# Altium schematic sheet Voltage_Regulation_TI.SchDoc
size A4
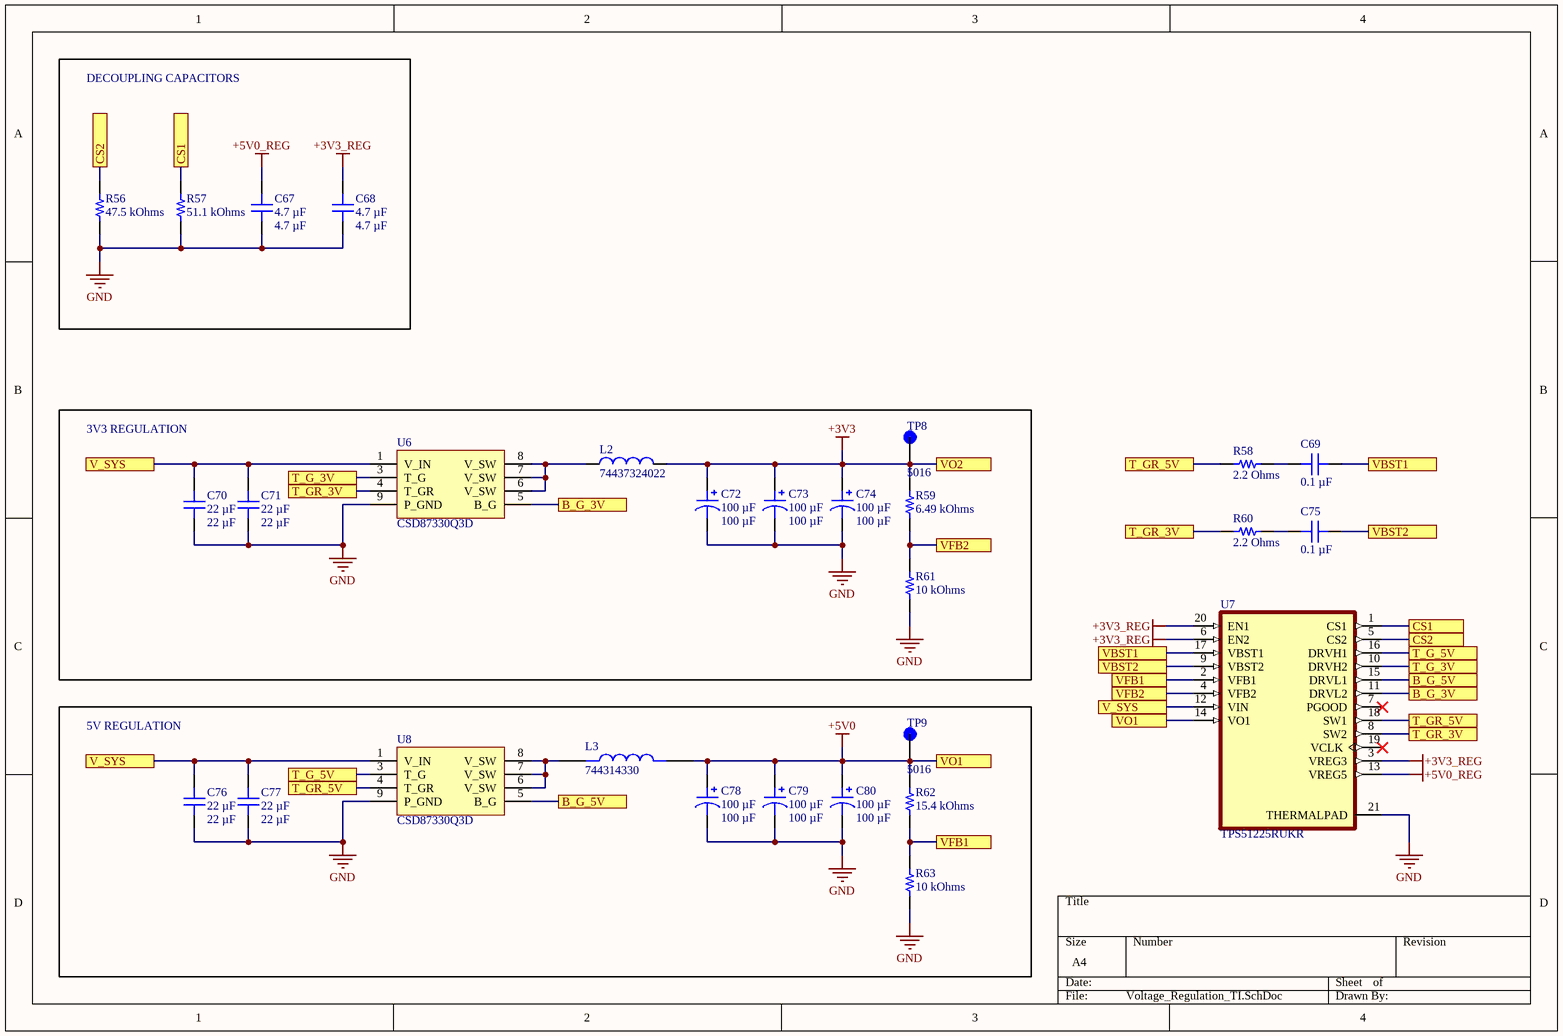
[diagram p0: Voltage_Regulation_TI.SchDoc]

## Parts
C67  4.7 µF  [CAP 0402_1005]
C68  4.7 µF  [CAP 0402_1005]
C69  0.1 µF  [CAP 0402_1005]
C70  22 µF  [CAP 0805_2012]
C71  22 µF  [CAP 0805_2012]
C72  100 µF  [CAP POL 1411_3528]
C73  100 µF  [CAP POL 1411_3528]
C74  100 µF  [CAP POL 1411_3528]
C75  0.1 µF  [CAP 0402_1005]
C76  22 µF  [CAP 0805_2012]
C77  22 µF  [CAP 0805_2012]
C78  100 µF  [CAP POL 1411_3528]
C79  100 µF  [CAP POL 1411_3528]
C80  100 µF  [CAP POL 1411_3528]
L2  74437324022  [IND_74437324022]
L3  744314330  [IND_744314330]
R56  47.5 kOhms  [RES 0402_1005]
R57  51.1 kOhms  [RES 0402_1005]
R58  2.2 Ohms  [RES 0402_1005]
R59  6.49 kOhms  [RES 0402_1005]
R60  2.2 Ohms  [RES 0402_1005]
R61  10 kOhms  [RES 0402_1005]
R62  15.4 kOhms  [RES 0402_1005]
R63  10 kOhms  [RES 0402_1005]
TP8  5016  [KEYSTONE_5016]  (no BOM)
TP9  5016  [KEYSTONE_5016]  (no BOM)
U6  CSD87330Q3D  [Q3D]
U7  TPS51225RUKR  [QFN40P300X300X80-21N]
U8  CSD87330Q3D  [Q3D]

## Blocks framed on the sheet
DECOUPLING CAPACITORS: C67 C68 R56 R57
3V3 REGULATION: C70-C74 L2 R59 R61 TP8 U6
5V REGULATION: C76-C80 L3 R62 R63 TP9 U8

## Ports
B_G_3V, B_G_5V, CS1, CS2, T_G_3V, T_G_5V, T_GR_3V, T_GR_5V, V_SYS, VBST1, VBST2, VFB1, VFB2, VO1, VO2

## Nets
+3V3: C72.1 C73.1 C74.1 L2.2 R59.2 TP8.TP ; port VO2
+3V3_REG: C68.2 U7.3(VREG3) U7.6(EN2) U7.20(EN1)
+5V0: C78.1 C79.1 C80.1 L3.2 R62.2 TP9.TP U7.14(VO1) ; port VO1
+5V0_REG: C67.2 U7.13(VREG5)
GND: C67.1 C68.1 C70.1 C71.1 C72.2 C73.2 C74.2 C76.1 C77.1 C78.2 C79.2 C80.2 R56.1 R57.1 R61.2 R63.2 U6.9(P_GND) U7.21(THERMALPAD) U8.9(P_GND)
B_G_3V: U6.5(B_G) U7.11(DRVL2) ; port B_G_3V
B_G_5V: U7.15(DRVL1) U8.5(B_G) ; port B_G_5V
CS1: R57.2 U7.1(CS1) ; port CS1
CS2: R56.2 U7.5(CS2) ; port CS2
T_G_3V: U6.3(T_G) U7.10(DRVH2) ; port T_G_3V
T_G_5V: U7.16(DRVH1) U8.3(T_G) ; port T_G_5V
T_GR_3V: R60.1 U6.4(T_GR) U7.8(SW2) ; port T_GR_3V
T_GR_5V: R58.1 U7.18(SW1) U8.4(T_GR) ; port T_GR_5V
V_SYS: C70.2 C71.2 C76.2 C77.2 U6.1(V_IN) U7.12(VIN) U8.1(V_IN) ; port V_SYS
VBST1: C69.1 U7.17(VBST1) ; port VBST1
VBST2: C75.1 U7.9(VBST2) ; port VBST2
VFB1: R62.1 R63.1 U7.2(VFB1) ; port VFB1
VFB2: R59.1 R61.1 U7.4(VFB2) ; port VFB2
NetC69_2: C69.2 R58.2
NetC75_2: C75.2 R60.2
NetL2_1: L2.1 U6.6(V_SW) U6.7(V_SW) U6.8(V_SW)
NetL3_1: L3.1 U8.6(V_SW) U8.7(V_SW) U8.8(V_SW)

Not connected (* = marked no-connect by the designer): U7 7(PGOOD)* 19(VCLK)*

## Library data of the parts
C67 C68 = CL05A475MO5NUNC: CAP CER 4.7UF 16V X5R 0402; manufacturer: Samsung Electro-Mechanics; Tolerance: ±20%; Part Number: CL05A475MO5NUNC; Value: 4.7 µF; Applications: General Purpose; Capacitance: 4.7 µF; componentlink1description: Datasheet; componentlink1url: http://www.samsungsem.com/kr/support/product-search/mlcc/__icsFiles/afieldfile/2019/05/29/Data%20sheet_CL05A475MO5NUNC.pdf; componentlink2description: DigiKey Link; componentlink2url: https://www.digikey.com/en/products/detail/samsung-electro-mechanics/CL05A475MO5NUNC/5961320; Device Package: 0402 (1005 Metric); lastupdated: 27/04/2023 7:05:02 PM; Lifecycle Status: Active; Minimum Order: 1; Mounting Type: Surface Mount, MLCC; Operating Temperature: -55°C ~ 85°C; Package / Case: 0402 (1005 Metric); packaging: TapeAndReel; partid: 1760; Part Status: Active; price: 0.08; series: CL; Size / Dimension: 0.039" L x 0.020" W (1.00mm x 0.50mm); Supplier 1: DigiKey; Supplier Part Number 1: 1276-6836-1-ND; Temperature Coefficient: X5R; Thickness (Max): 0.028" (0.70mm); Voltage - Rated: 16V
C69 C75 = 885012105001: CAP CER 0.1UF 6.3V X5R 0402; manufacturer: Würth Elektronik; Tolerance: ±20%; Part Number: 885012105001; Value: 0.1 µF; Applications: General Purpose; Capacitance: 0.1 µF; componentlink1description: Datasheet; componentlink1url: https://katalog.we-online.de/pbs/datasheet/885012105001.pdf; componentlink2description: DigiKey Link; componentlink2url: https://www.digikey.com/en/products/detail/würth-elektronik/885012105001/5453333; Device Package: 0402 (1005 Metric); lastupdated: 26/04/2023 7:02:37 PM; Lifecycle Status: Active; Minimum Order: 1; Mounting Type: Surface Mount, MLCC; Operating Temperature: -55°C ~ 85°C; Package / Case: 0402 (1005 Metric); packaging: TapeAndReel; partid: 1931; Part Status: Active; price: 0.01; series: WCAP-CSGP; Size / Dimension: 0.039" L x 0.020" W (1.00mm x 0.50mm); Supplier 1: DigiKey; Supplier Part Number 1: 732-7478-1-ND; Temperature Coefficient: X5R; Thickness (Max): 0.022" (0.55mm); Voltage - Rated: 6.3V
C70 C71 C76 C77 = C2012X5R1V226M125AC: CAP CER 22UF 35V X5R 0805; manufacturer: TDK Corporation; Tolerance: ±20%; Part Number: C2012X5R1V226M125AC; Value: 22 µF; Applications: General Purpose; Capacitance: 22 µF; componentlink1description: Datasheet; componentlink1url: https://product.tdk.com/info/en/catalog/datasheets/mlcc_commercial_general_en.pdf?ref_disty=digikey; componentlink2description: DigiKey Link; componentlink2url: https://www.digikey.com/en/products/detail/tdk-corporation/C2012X5R1V226M125AC/3951664; Device Package: 0805 (2012 Metric); Features: Low ESL; lastupdated: 27/04/2023 7:13:26 PM; Lifecycle Status: Active; Minimum Order: 1; Mounting Type: Surface Mount, MLCC; Operating Temperature: -55°C ~ 85°C; Package / Case: 0805 (2012 Metric); packaging: TapeAndReel; partid: 45365; Part Status: Active; price: 0.28; series: C; Size / Dimension: 0.079" L x 0.049" W (2.00mm x 1.25mm); Supplier 1: DigiKey; Supplier Part Number 1: 445-14428-1-ND; Temperature Coefficient: X5R; Thickness (Max): 0.057" (1.45mm); Voltage - Rated: 35V
C72-C74 C78-C80 = ATCC-211B-010-107M-T: CAP TANT 100UF 20% 10V 1411; manufacturer: Abracon LLC; Manufacturer Size Code: B; ESR (Equivalent Series Resistance): 1.5Ohm; Type: Molded; Part Number: ATCC-211B-010-107M-T; Value: 100 µF; Capacitance: 100 µF; componentlink1description: Datasheet; componentlink1url: https://abracon.com/Magnetics/inductors/ATCC-211.pdf; componentlink2description: DigiKey Link; componentlink2url: https://www.digikey.com/en/products/detail/abracon-llc/ATCC-211B-010-107M-T/4245645; Device Package: 1411 (3528 Metric); Features: General Purpose; Height - Seated (Max): 0.083" (2.10mm); lastupdated: 27/04/2023 7:52:12 PM; Lifecycle Status: Active; Minimum Order: 1; Mounting Type: Surface Mount; Operating Temperature: -55°C ~ 125°C; Package / Case: 1411 (3528 Metric); packaging: TapeAndReel; partid: 25; Part Status: Active; price: 0.45; series: ATCC-211; Size / Dimension: 0.138" L x 0.110" W (3.50mm x 2.80mm); Supplier 1: DigiKey; Supplier Part Number 1: ATCC-211B-010-107M-TCT-ND; Tolerance: ±20%; Voltage - Rated: 10 V
L2 = 74437324022: LHMI Inductor 4020 2.2uH 5.0A 27.0mOhm; MF: {'manufacturer': u'W\xfcrth Elektronik'}; Value: 2.2µH; Availability: Unavailable; Price: None; MP: 74437324022; Package: None
L3 = 744314330: Inductor SMD 7050 3.3µH 9 A Wuerth Elektronik WE-HCI 744314330 1 pc(s); MF: {'manufacturer': u'Wurth Electronics'}; MP: 744314330; Value: 3.3µH; Package: None; Price: None; Availability: Unavailable
R56 = RC0402FR-0747K5L: RES 47.5K OHM 1% 1/16W 0402; Manufacturer: Yageo; Power (Watts): 0.063W, 1/16W; Temperature Coefficient: ±100ppm/°C; Part Number: RC0402FR-0747K5L; Value: 47.5 kOhms; ComponentLink1Description: Datasheet; ComponentLink1URL: https://www.yageo.com/upload/media/product/productsearch/datasheet/rchip/PYu-RC_Group_51_RoHS_L_10.pdf; ComponentLink2Description: DigiKey Link; ComponentLink2URL: https://www.digikey.com/en/products/detail/yageo/RC0402FR-0747K5L/726617; Composition: Thick Film; Device Package: 0402 (1005 Metric); Features: Moisture Resistant; Height - Seated (Max): 0.016" (0.40mm); LastUpdated: 27/04/2023 7:26:05 PM; Lifecycle Status: Active; Minimum Order: 1; Number of Terminations: 2; Operating Temperature: -55°C ~ 155°C; Package / Case: 0402 (1005 Metric); Packaging: CutTape; PartId: 2538; Part Status: Active; Price: 0.01; Resistance: 47.5 kOhms; Series: RC_L; Size / Dimension: 0.039" L x 0.020" W (1.00mm x 0.50mm); Supplier 1: DigiKey; Supplier Part Number 1: 311-47.5KLRCT-ND; Supplier Device Package: 0402; Tolerance: ±1%
R57 = CR0402-FX-5112GLF: RES SMD 51.1K OHM 1% 1/16W 0402; Manufacturer: Bourns Inc.; Power (Watts): 0.063W, 1/16W; Temperature Coefficient: ±100ppm/°C; Part Number: CR0402-FX-5112GLF; Value: 51.1 kOhms; ComponentLink1Description: Datasheet; ComponentLink1URL: https://www.bourns.com/docs/Product-Datasheets/CR0402.pdf; ComponentLink2Description: DigiKey Link; ComponentLink2URL: https://www.digikey.com/en/products/detail/bourns-inc/CR0402-FX-5112GLF/3783414; Composition: Thick Film; Device Package: 0402 (1005 Metric); Height - Seated (Max): 0.016" (0.40mm); LastUpdated: 27/04/2023 7:25:58 PM; Lifecycle Status: Active; Minimum Order: 1; Number of Terminations: 2; Operating Temperature: -55°C ~ 155°C; Package / Case: 0402 (1005 Metric); Packaging: CutTape; PartId: 4388; Part Status: Active; Price: 0.01; Resistance: 51.1 kOhms; Series: CR0402; Size / Dimension: 0.039" L x 0.020" W (1.00mm x 0.50mm); Supplier 1: DigiKey; Supplier Part Number 1: CR0402-FX-5112GLFCT-ND; Supplier Device Package: 0402; Tolerance: ±1%
R58 R60 = RC0402JR-072R2L: RES 2.2 OHM 5% 1/16W 0402; Manufacturer: Yageo; Power (Watts): 0.063W, 1/16W; Temperature Coefficient: ±200ppm/°C; Part Number: RC0402JR-072R2L; Value: 2.2 Ohms; ComponentLink1Description: Datasheet; ComponentLink1URL: https://www.yageo.com/upload/media/product/productsearch/datasheet/rchip/PYu-RC_Group_51_RoHS_L_10.pdf; ComponentLink2Description: DigiKey Link; ComponentLink2URL: https://www.digikey.com/en/products/detail/yageo/RC0402JR-072R2L/726435; Composition: Thick Film; Device Package: 0402 (1005 Metric); Features: Moisture Resistant; Height - Seated (Max): 0.016" (0.40mm); LastUpdated: 27/04/2023 7:26:02 PM; Lifecycle Status: Active; Minimum Order: 1; Number of Terminations: 2; Operating Temperature: -55°C ~ 155°C; Package / Case: 0402 (1005 Metric); Packaging: CutTape; PartId: 3413; Part Status: Active; Price: 0.01; Resistance: 2.2 Ohms; Series: RC_L; Size / Dimension: 0.039" L x 0.020" W (1.00mm x 0.50mm); Supplier 1: DigiKey; Supplier Part Number 1: 311-2.2JRCT-ND; Supplier Device Package: 0402; Tolerance: ±5%
R59 = RC0402FR-076K49L: RES 6.49K OHM 1% 1/16W 0402; Manufacturer: Yageo; Power (Watts): 0.063W, 1/16W; Temperature Coefficient: ±100ppm/°C; Part Number: RC0402FR-076K49L; Value: 6.49 kOhms; ComponentLink1Description: Datasheet; ComponentLink1URL: https://www.yageo.com/upload/media/product/productsearch/datasheet/rchip/PYu-RC_Group_51_RoHS_L_10.pdf; ComponentLink2Description: DigiKey Link; ComponentLink2URL: https://www.digikey.com/en/products/detail/yageo/RC0402FR-076K49L/726641; Composition: Thick Film; Device Package: 0402 (1005 Metric); Features: Moisture Resistant; Height - Seated (Max): 0.016" (0.40mm); LastUpdated: 27/04/2023 7:26:05 PM; Lifecycle Status: Active; Minimum Order: 1; Number of Terminations: 2; Operating Temperature: -55°C ~ 155°C; Package / Case: 0402 (1005 Metric); Packaging: CutTape; PartId: 2571; Part Status: Active; Price: 0.01; Resistance: 6.49 kOhms; Series: RC_L; Size / Dimension: 0.039" L x 0.020" W (1.00mm x 0.50mm); Supplier 1: DigiKey; Supplier Part Number 1: 311-6.49KLRCT-ND; Supplier Device Package: 0402; Tolerance: ±1%
R61 R63 = RC0402JR-1310KL: RES 10K OHM 5% 1/16W 0402; Manufacturer: Yageo; Power (Watts): 0.063W, 1/16W; Temperature Coefficient: ±100ppm/°C; Part Number: RC0402JR-1310KL; Value: 10 kOhms; ComponentLink1Description: Datasheet; ComponentLink1URL: https://www.yageo.com/upload/media/product/productsearch/datasheet/rchip/PYu-RC_Group_51_RoHS_L_11.pdf; ComponentLink2Description: DigiKey Link; ComponentLink2URL: https://www.digikey.com/en/products/detail/yageo/RC0402JR-1310KL/13694115; Composition: Thick Film; Device Package: 0402 (1005 Metric); Features: Moisture Resistant; Height - Seated (Max): 0.016" (0.40mm); LastUpdated: 4/04/2023 7:21:31 PM; Lifecycle Status: Active; Minimum Order: 50000; Number of Terminations: 2; Operating Temperature: -55°C ~ 155°C; Package / Case: 0402 (1005 Metric); PartId: 69237; Part Status: Active; Price: 0; Resistance: 10 kOhms; Series: RC_L; Size / Dimension: 0.039" L x 0.020" W (1.00mm x 0.50mm); Supplier 1: DigiKey; Supplier Part Number 1: 13-RC0402JR-1310KLTR-ND; Supplier Device Package: 0402; Tolerance: ±5%
R62 = RC0402FR-0715K4L: RES 15.4K OHM 1% 1/16W 0402; Manufacturer: Yageo; Power (Watts): 0.063W, 1/16W; Temperature Coefficient: ±100ppm/°C; Part Number: RC0402FR-0715K4L; Value: 15.4 kOhms; ComponentLink1Description: Datasheet; ComponentLink1URL: https://www.yageo.com/upload/media/product/productsearch/datasheet/rchip/PYu-RC_Group_51_RoHS_L_10.pdf; ComponentLink2Description: DigiKey Link; ComponentLink2URL: https://www.digikey.com/en/products/detail/yageo/RC0402FR-0715K4L/5280852; Composition: Thick Film; Device Package: 0402 (1005 Metric); Features: Moisture Resistant; Height - Seated (Max): 0.016" (0.40mm); LastUpdated: 27/04/2023 7:26:05 PM; Lifecycle Status: Active; Minimum Order: 1; Number of Terminations: 2; Operating Temperature: -55°C ~ 155°C; Package / Case: 0402 (1005 Metric); Packaging: CutTape; PartId: 2575; Part Status: Active; Price: 0.01; Resistance: 15.4 kOhms; Series: RC_L; Size / Dimension: 0.039" L x 0.020" W (1.00mm x 0.50mm); Supplier 1: DigiKey; Supplier Part Number 1: YAG2992CT-ND; Supplier Device Package: 0402; Tolerance: ±1%
TP8 TP9 = 5016: MF: {'manufacturer': u'Keystone Electronics'}; Package: None; MP: 5016; Value: *; Price: None; Availability: Unavailable
U6 U8 = CSD87330Q3D: Synchronous Buck NexFET™ Power Block
U7 = TPS51225RUKR: MF: {'manufacturer': u'Texas Instruments'}; Package: None; MP: TPS51225RUKR; Value: *; Price: None; Availability: Unavailable